# EAGLE schematic BPSDSchematic2.1 (EAGLE 6.5.1)
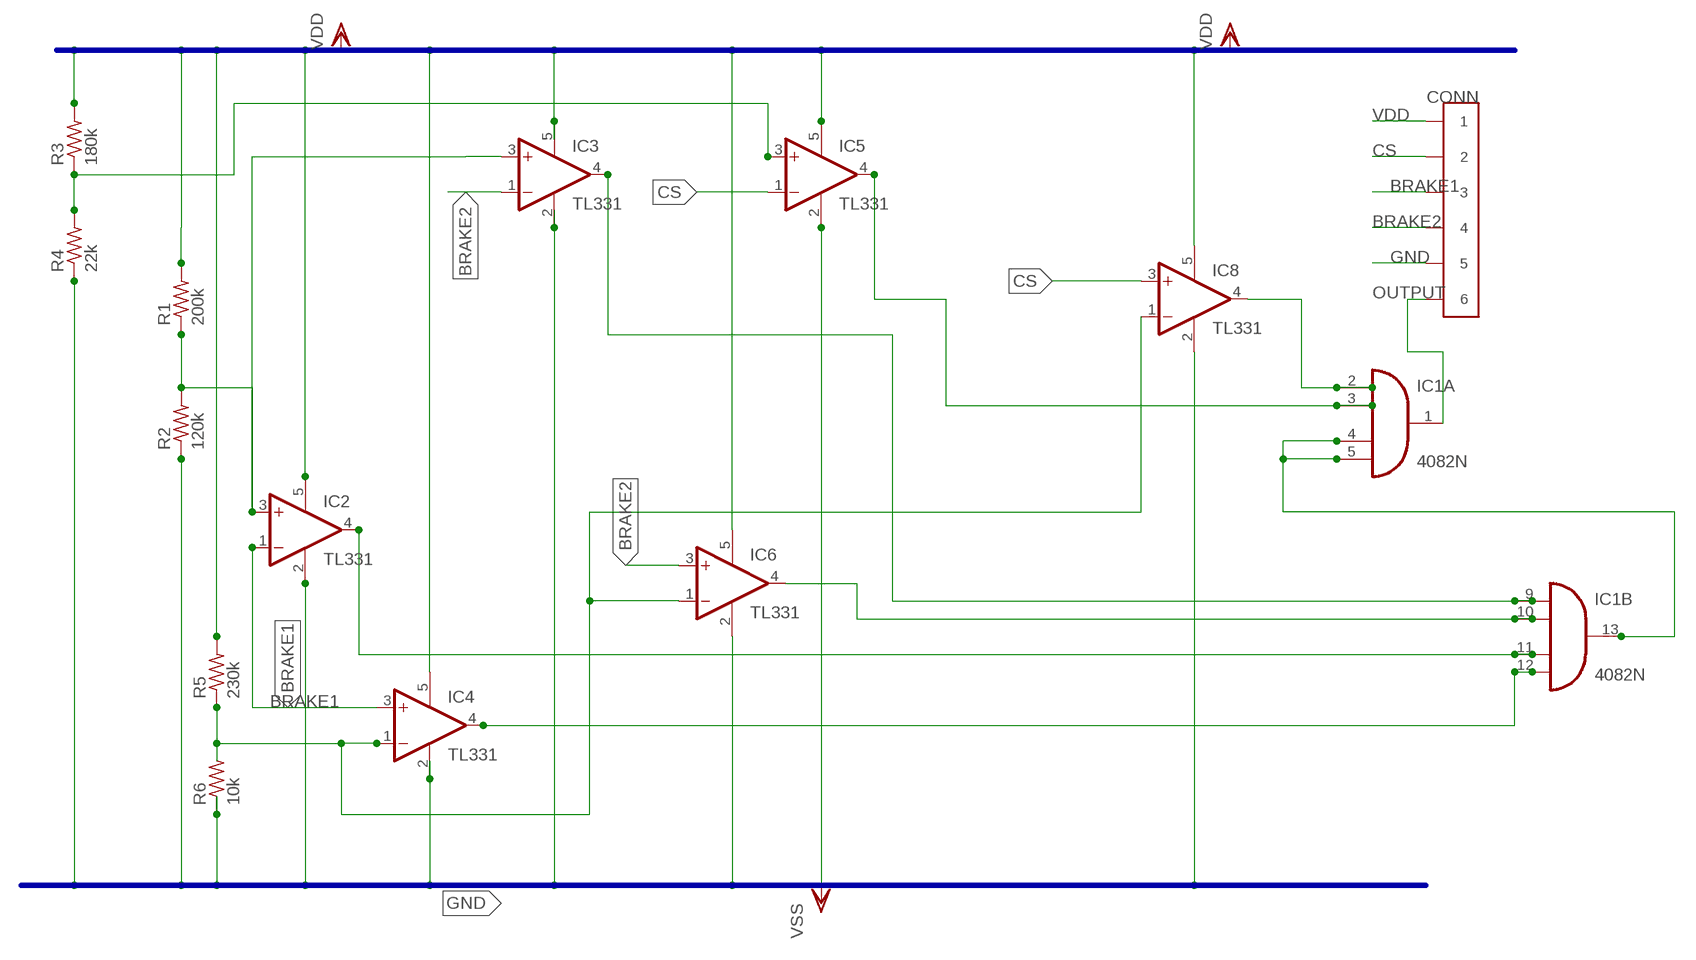
[diagram p0: schematic, sheet 1]

## Parts
CONN  CONN_6  [CONNECTOR_6]
IC1  4082N  [DIL14]
IC2  TL331  [DBV-R-PDSO-G5]
IC3  TL331  [DBV-R-PDSO-G5]
IC4  TL331  [DBV-R-PDSO-G5]
IC5  TL331  [DBV-R-PDSO-G5]
IC6  TL331  [DBV-R-PDSO-G5]
IC8  TL331  [DBV-R-PDSO-G5]
R1  200k  R-US_0207/15  [0207/15]
R2  120k  R-US_0207/15  [0207/15]
R3  180k  R-US_0207/15  [0207/15]
R4  22k  R-US_0207/15  [0207/15]
R5  230k  R-US_0207/15  [0207/15]
R6  10k  R-US_0207/15  [0207/15]

## Nets
BRAKE1: CONN.5 CONN.6 IC2.1(-IN) IC4.3(+IN)
BRAKE2: CONN.7 CONN.8 IC3.1(-IN) IC6.3(+IN)
CS: CONN.3 CONN.4 IC5.1(-IN) IC8.3(+IN)
GND: CONN.9 CONN.10 IC2.2(GND) IC3.2(GND) IC4.2(GND) IC5.2(GND) IC6.2(GND) IC8.2(GND) R2.1 R4.1 R6.1 ; supply symbol labelled VSS
N$3: IC1.12(B:I3) IC4.4(OUT)
N$4: IC1.11(B:I2) IC2.4(OUT)
N$5: IC1.10(B:I1) IC6.4(OUT)
N$6: IC1.9(B:I0) IC3.4(OUT)
N$7: IC1.2(A:I0) IC8.4(OUT)
N$9: IC1.4(A:I2) IC1.5(A:I3) IC1.13(B:O)
N$10: IC2.3(+IN) IC3.3(+IN) R1.1 R2.2
N$11: IC4.1(-IN) IC6.1(-IN) IC8.1(-IN) R5.1 R6.2
N$15: IC5.3(+IN) R3.1 R4.2
N$17: IC1.3(A:I1) IC5.4(OUT)
OUTPUT: CONN.11 CONN.12 IC1.1(A:O)
VDD: CONN.1 CONN.2 IC2.5(V+) IC3.5(V+) IC4.5(V+) IC5.5(V+) IC6.5(V+) IC8.5(V+) R1.2 R3.2 R5.2

## Buses
GND
VDD

## Power pins joined to a net without a drawn wire
VDD: IC1.14(P:VDD)
VSS: IC1.7(P:VSS)

## Library data of the parts
CONN = formula electric:CONN_6
IC1 = 40xx:4082: Dual 4-input AND
IC2-IC6 IC8 = linear:TL331: SINGLE DIFFERENTIAL COMPARATOR Source: Data sheet <http://www.ti.com/lit/ds/symlink/tl331-q1.pdf>
R1-R6 = rcl:R-US_: RESISTOR, American symbol

## Net classes
0 default: width 0.305 mm, drill 0.508 mm, clearance 0.254 mm